# EAGLE schematic owl-digital-2 (EAGLE 6.6.0)
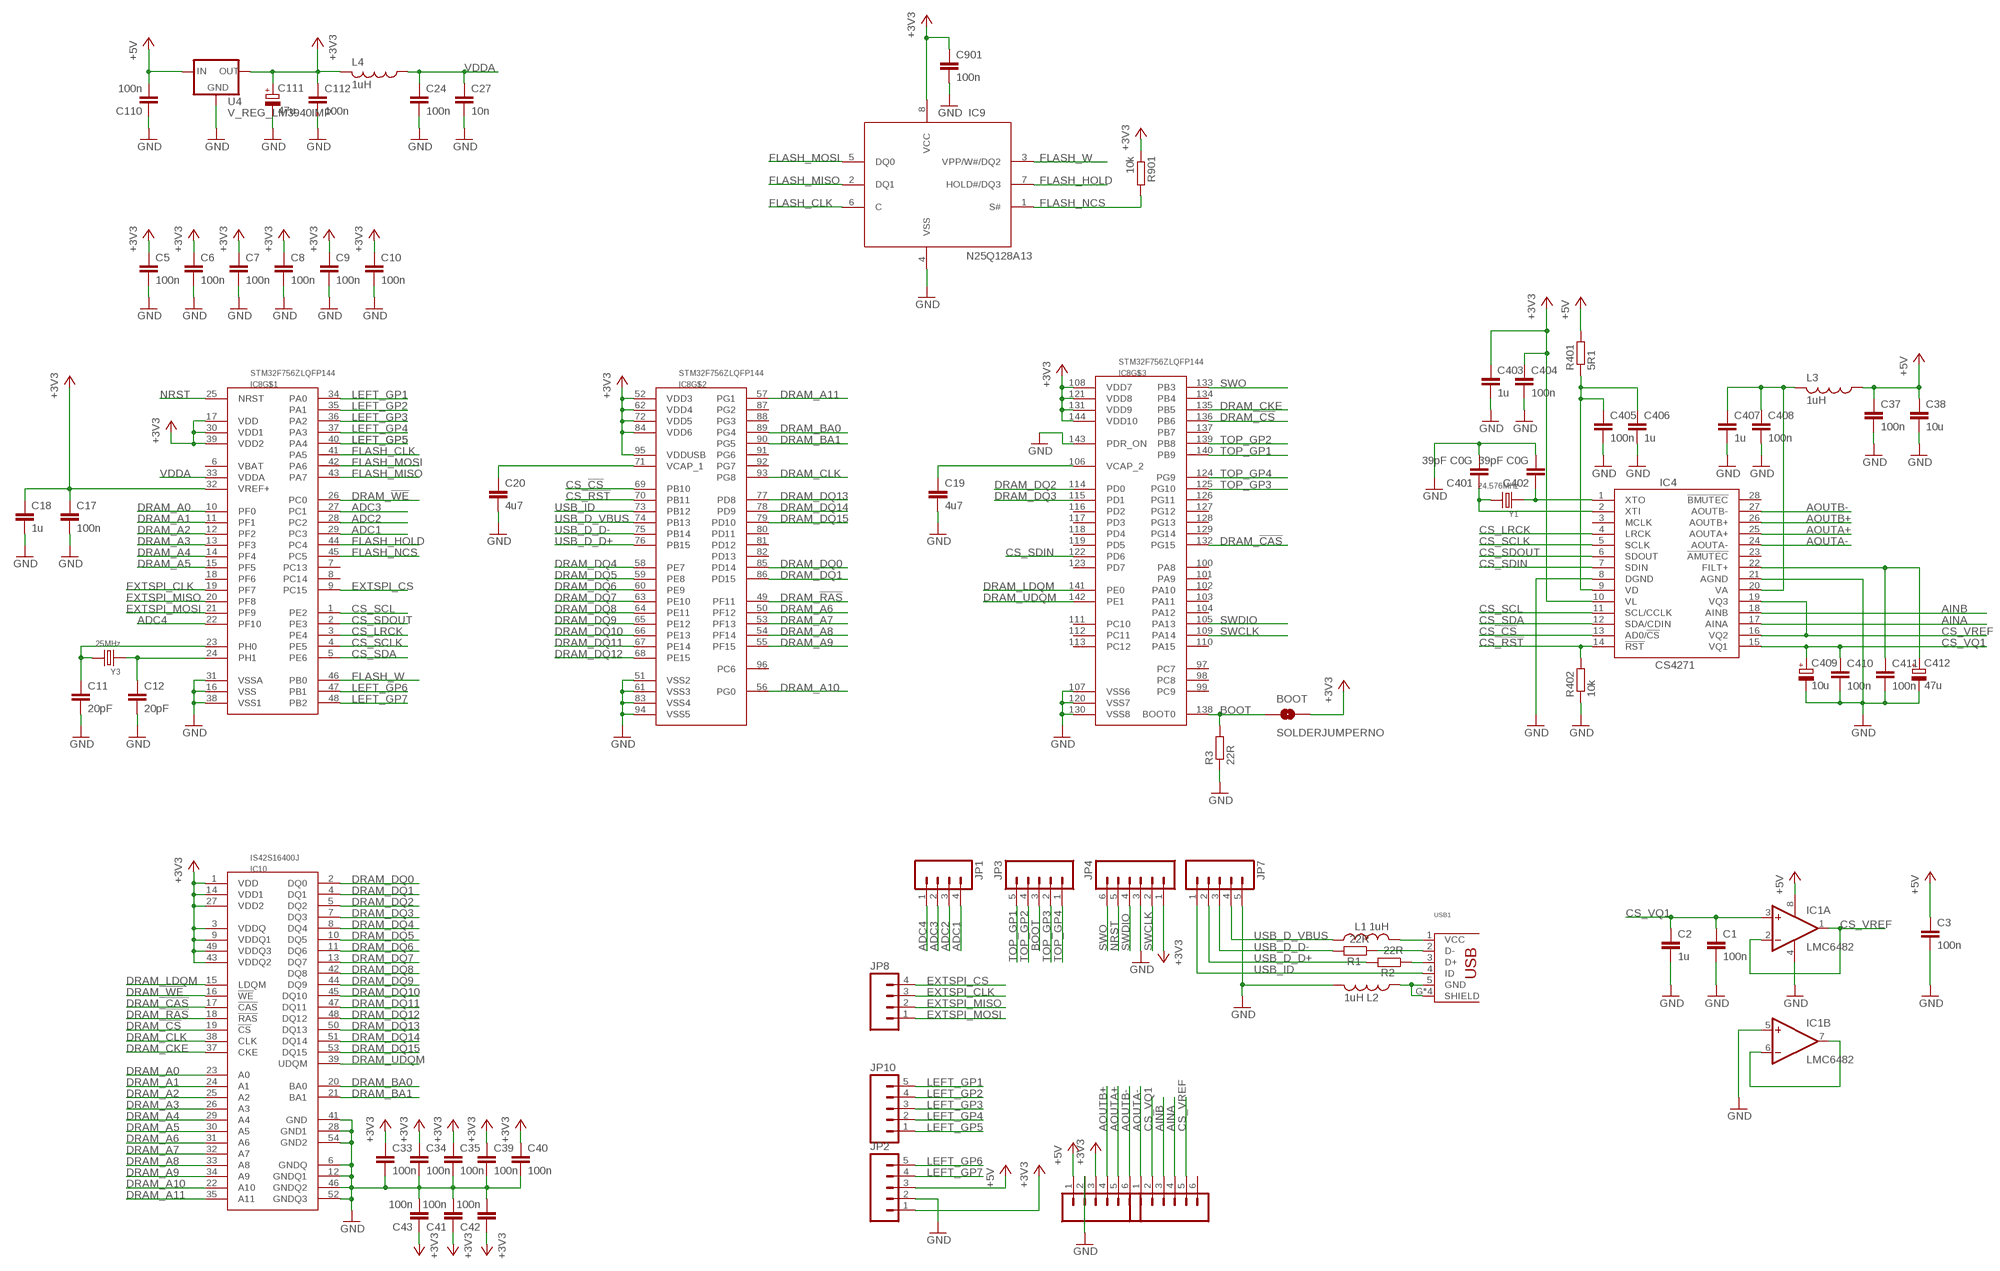
[diagram p0: schematic, sheet 1]

## Parts
BOOT  SOLDERJUMPERNO  [SJ_2S-NO]
C1  100n  C-EUC0603  [C0603]
C2  1u  C-EUC0603  [C0603]
C3  100n  C-EUC0603  [C0603]
C5  100n  C-EUC0603  [C0603]
C6  100n  C-EUC0603  [C0603]
C7  100n  C-EUC0603  [C0603]
C8  100n  C-EUC0603  [C0603]
C9  100n  C-EUC0603  [C0603]
C10  100n  C-EUC0603  [C0603]
C11  20pF  C-EUC0603  [C0603]
C12  20pF  C-EUC0603  [C0603]
C17  100n  C-EUC0603  [C0603]
C18  1u  C-EUC0603  [C0603]
C19  4u7  C-EUC0603  [C0603]
C20  4u7  C-EUC0603  [C0603]
C24  100n  C-EUC0603  [C0603]
C27  10n  C-EUC0603  [C0603]
C33  100n  C-EUC0603  [C0603]
C34  100n  C-EUC0603  [C0603]
C35  100n  C-EUC0603  [C0603]
C37  100n  C-EUC0603  [C0603]
C38  10u  C-EUC1206  [C1206]
C39  100n  C-EUC0603  [C0603]
C40  100n  C-EUC0603  [C0603]
C41  100n  C-EUC0603  [C0603]
C42  100n  C-EUC0603  [C0603]
C43  100n  C-EUC0603  [C0603]
C110  100n  C-EUC0603  [C0603]
C111  47u  CPOL-EU153CLV-0505  [CPOL-5]
C112  100n  C-EUC0603  [C0603]
C401  39pF C0G  C-EUC0603  [C0603]
C402  39pF C0G  C-EUC0603  [C0603]
C403  1u  C-EUC0603  [C0603]
C404  100n  C-EUC0603  [C0603]
C405  100n  C-EUC0603  [C0603]
C406  1u  C-EUC0603  [C0603]
C407  1u  C-EUC0603  [C0603]
C408  100n  C-EUC0603  [C0603]
C409  10u  CPOL-EU153CLV-0505  [CPOL-5]
C410  100n  C-EUC0603  [C0603]
C411  100n  C-EUC0603  [C0603]
C412  47u  CPOL-EU153CLV-0505  [CPOL-5]
C901  100n  C-EUC0603  [C0603]
IC1  LMC6482  LM1458D  [SO08]
IC4  CS4271  [TSSOP28-0.65-9.7X4.4MM]
IC8  STM32F756ZLQFP144  [QFP50P2200X2200X160-144N]
IC9  N25Q128A13  [SO8W]
IC10  IS42S16400J  [TSOP54-400]
JP1  M04PTH  [1X04]
JP2  M05PTH  [1X05]
JP3  M05PTH  [1X05]
JP4  M06SIP  [1X06]
JP5  M06SIP  [1X06]
JP6  M06SIP  [1X06]
JP7  M05PTH  [1X05]
JP8  M04PTH  [1X04]
JP10  M05PTH  [1X05]
L1  1uH  INDUCTOR  [0603]
L2  1uH  INDUCTOR  [0603]
L3  1uH  INDUCTOR  [0603]
L4  1uH  INDUCTOR  [0603]
R1  22R  R-EU_0603  [0603]
R2  22R  R-EU_0603  [0603]
R3  22R  R-EU_0603  [0603]
R401  5R1  R-EU_0603  [0603]
R402  10k  R-EU_0603  [0603]
R901  10k  R-EU_0603  [0603]
U4  V_REG_LM3940IMP  [SOT223]
USB1  USB_HRS_ZX62-B-5PA(11)MICRO.B  [HRS_ZX62RD-AB-5P8]
Y1  24.576MHz  SMD-CRYSTAL-8MHZ-20PF-20PPM(2P-5.0X3.2MM)  [X2-SMD-5.0X3.2X1.3MM]
Y3  25MHz  SMD-CRYSTAL-8MHZ-20PF-20PPM(2P-5.0X3.2MM)  [X2-SMD-5.0X3.2X1.3MM]

## Nets
+3V3: BOOT.2 C5.1 C6.1 C7.1 C8.1 C9.1 C10.1 C17.1 C18.1 C33.1 C34.1 C35.1 C39.1 C40.1 C41.1 C42.1 C43.1 C111.+ C112.1 C403.1 C404.1 C901.1 IC4.10(VL) IC8.17(VDD) IC8.30(VDD1) IC8.32(VREF+) IC8.39(VDD2) IC8.52(VDD3) IC8.62(VDD4) IC8.72(VDD5) IC8.84(VDD6) IC8.95(VDDUSB) IC8.108(VDD7) IC8.121(VDD8) IC8.131(VDD9) IC8.144(VDD10) IC9.8(VCC) IC10.1(VDD) IC10.3(VDDQ) IC10.9(VDDQ1) IC10.14(VDD1) IC10.27(VDD2) IC10.43(VDDQ2) IC10.49(VDDQ3) JP2.1 JP4.1 JP5.3 L4.2 R901.1 U4.3(OUT)
+5V [power]: C3.1 C37.1 C38.1 C110.2 IC1.8(P:V+) JP2.3 JP5.1 L3.1 R401.2 U4.1(IN)
ADC1: IC8.29(PC3) JP1.4
ADC2: IC8.28(PC2) JP1.3
ADC3: IC8.27(PC1) JP1.2
ADC4: IC8.22(PF10) JP1.1
AINA: IC4.17(AINA) JP6.4
AINB: IC4.18(AINB) JP6.3
AOUTA+: IC4.25(AOUTA+) JP5.5
AOUTA-: IC4.24(AOUTA-) JP6.1
AOUTB+: IC4.26(AOUTB+) JP5.4
AOUTB-: IC4.27(AOUTB-) JP5.6
BOOT: BOOT.1 IC8.138(BOOT0) JP3.3 R3.2
CS_!CS: IC4.13(AD0/!CS) IC8.69(PB10)
CS_!RST: IC4.14(!RST) IC8.70(PB11) R402.2
CS_LRCK: IC4.4(LRCK) IC8.3(PE4)
CS_SCL: IC4.11(SCL/CCLK) IC8.1(PE2)
CS_SCLK: IC4.5(SCLK) IC8.4(PE5)
CS_SDA: IC4.12(SDA/CDIN) IC8.5(PE6)
CS_SDIN: IC4.7(SDIN) IC8.122(PD6)
CS_SDOUT: IC4.6(SDOUT) IC8.2(PE3)
CS_VQ1: C1.1 C2.1 C409.+ C410.1 IC1.3(A:+IN) IC4.15(VQ1) JP6.2
CS_VREF: IC1.1(A:OUT) IC1.2(A:-IN) IC4.16(VQ2) IC4.19(VQ3) JP6.5
DRAM_!CAS: IC8.132(PG15) IC10.17(!CAS)
DRAM_!CS: IC8.136(PB6) IC10.19(!CS)
DRAM_!RAS: IC8.49(PF11) IC10.18(!RAS)
DRAM_!WE: IC8.26(PC0) IC10.16(!WE)
DRAM_A0: IC8.10(PF0) IC10.23(A0)
DRAM_A1: IC8.11(PF1) IC10.24(A1)
DRAM_A2: IC8.12(PF2) IC10.25(A2)
DRAM_A3: IC8.13(PF3) IC10.26(A3)
DRAM_A4: IC8.14(PF4) IC10.29(A4)
DRAM_A5: IC8.15(PF5) IC10.30(A5)
DRAM_A6: IC8.50(PF12) IC10.31(A6)
DRAM_A7: IC8.53(PF13) IC10.32(A7)
DRAM_A8: IC8.54(PF14) IC10.33(A8)
DRAM_A9: IC8.55(PF15) IC10.34(A9)
DRAM_A10: IC8.56(PG0) IC10.22(A10)
DRAM_A11: IC8.57(PG1) IC10.35(A11)
DRAM_BA0: IC8.89(PG4) IC10.20(BA0)
DRAM_BA1: IC8.90(PG5) IC10.21(BA1)
DRAM_CKE: IC8.135(PB5) IC10.37(CKE)
DRAM_CLK: IC8.93(PG8) IC10.38(CLK)
DRAM_DQ0: IC8.85(PD14) IC10.2(DQ0)
DRAM_DQ1: IC8.86(PD15) IC10.4(DQ1)
DRAM_DQ2: IC8.114(PD0) IC10.5(DQ2)
DRAM_DQ3: IC8.115(PD1) IC10.7(DQ3)
DRAM_DQ4: IC8.58(PE7) IC10.8(DQ4)
DRAM_DQ5: IC8.59(PE8) IC10.10(DQ5)
DRAM_DQ6: IC8.60(PE9) IC10.11(DQ6)
DRAM_DQ7: IC8.63(PE10) IC10.13(DQ7)
DRAM_DQ8: IC8.64(PE11) IC10.42(DQ8)
DRAM_DQ9: IC8.65(PE12) IC10.44(DQ9)
DRAM_DQ10: IC8.66(PE13) IC10.45(DQ10)
DRAM_DQ11: IC8.67(PE14) IC10.47(DQ11)
DRAM_DQ12: IC8.68(PE15) IC10.48(DQ12)
DRAM_DQ13: IC8.77(PD8) IC10.50(DQ13)
DRAM_DQ14: IC8.78(PD9) IC10.51(DQ14)
DRAM_DQ15: IC8.79(PD10) IC10.53(DQ15)
DRAM_LDQM: IC8.141(PE0) IC10.15(LDQM)
DRAM_UDQM: IC8.142(PE1) IC10.39(UDQM)
EXTSPI_CLK: IC8.19(PF7) JP8.3
EXTSPI_CS: IC8.9(PC15) JP8.4
EXTSPI_MISO: IC8.20(PF8) JP8.2
EXTSPI_MOSI: IC8.21(PF9) JP8.1
FLASH_CLK: IC8.41(PA5) IC9.6(C)
FLASH_HOLD: IC8.44(PC4) IC9.7(HOLD#/DQ3)
FLASH_MISO: IC8.43(PA7) IC9.2(DQ1)
FLASH_MOSI: IC8.42(PA6) IC9.5(DQ0)
FLASH_NCS: IC8.45(PC5) IC9.1(S#) R901.2
FLASH_W: IC8.46(PB0) IC9.3(VPP/W#/DQ2)
GND: C1.2 C2.2 C3.2 C5.2 C6.2 C7.2 C8.2 C9.2 C10.2 C11.2 C12.2 C17.2 C18.2 C19.2 C20.2 C24.2 C27.2 C33.2 C34.2 C35.2 C37.2 C38.2 C39.2 C40.2 C41.2 C42.2 C43.2 C110.1 C111.- C112.2 C401.2 C402.2 C403.2 C404.2 C405.2 C406.2 C407.2 C408.2 C409.- C410.2 C411.2 C412.- C901.2 IC1.4(P:V-) IC1.5(B:+IN) IC4.8(DGND) IC4.21(AGND) IC8.16(VSS) IC8.31(VSSA) IC8.38(VSS1) IC8.51(VSS2) IC8.61(VSS3) IC8.83(VSS4) IC8.94(VSS5) IC8.107(VSS6) IC8.120(VSS7) IC8.130(VSS8) IC8.143(PDR_ON) IC9.4(VSS) IC10.6(GNDQ) IC10.12(GNDQ1) IC10.28(GND1) IC10.41(GND) IC10.46(GNDQ2) IC10.52(GNDQ3) IC10.54(GND2) JP2.2 JP4.3 JP5.2 JP7.5 L2.2 R3.1 R402.1 U4.2(GND)
LEFT_GP1: IC8.34(PA0) JP10.5
LEFT_GP2: IC8.35(PA1) JP10.4
LEFT_GP3: IC8.36(PA2) JP10.3
LEFT_GP4: IC8.37(PA3) JP10.2
LEFT_GP5: IC8.40(PA4) JP10.1
LEFT_GP6: IC8.47(PB1) JP2.5
LEFT_GP7: IC8.48(PB2) JP2.4
N$1: L2.1 USB1.5(GND) USB1.G2(SHIELD) USB1.G3(SHIELD) USB1.G4(SHIELD) USB1.G(SHIELD)
N$2: L1.2 USB1.1(VCC)
N$3: IC1.6(B:-IN) IC1.7(B:OUT)
N$4: R2.1 USB1.3(D+)
N$5: R1.1 USB1.2(D-)
N$11: C12.1 IC8.24(PH1) Y3.1
N$17: C11.1 IC8.23(PH0) Y3.2
N$18: C402.1 IC4.1(XTO) Y1.1
N$20: C411.1 C412.+ IC4.22(FILT+)
N$21: C401.1 IC4.2(XTI) Y1.2
N$33: C19.1 IC8.106(VCAP_2)
N$34: C20.1 IC8.71(VCAP_1)
NRST: IC8.25(NRST) JP4.5
SWCLK: IC8.109(PA14) JP4.2
SWDIO: IC8.105(PA13) JP4.4
SWO: IC8.133(PB3) JP4.6
TOP_GP1: IC8.140(PB9) JP3.5
TOP_GP2: IC8.139(PB8) JP3.4
TOP_GP3: IC8.125(PG10) JP3.2
TOP_GP4: IC8.124(PG9) JP3.1
USB_D_D+: IC8.76(PB15) JP7.2 R2.2
USB_D_D-: IC8.75(PB14) JP7.3 R1.2
USB_D_VBUS: IC8.74(PB13) JP7.4 L1.1
USB_ID: IC8.73(PB12) JP7.1 USB1.4(ID)
VA: C407.1 C408.1 IC4.20(VA) L3.2
VD: C405.1 C406.1 IC4.9(VD) R401.1
VDDA: C24.1 C27.1 IC8.33(VDDA) L4.1
Unconnected: IC4.3(MCLK) IC4.23(!AMUTEC) IC4.28(!BMUTEC) IC8.6(VBAT) IC8.7(PC13) IC8.8(PC14) IC8.18(PF6) IC8.80(PD11) IC8.81(PD12) IC8.82(PD13) IC8.87(PG2) IC8.88(PG3) IC8.91(PG6) IC8.92(PG7) IC8.96(PC6) IC8.97(PC7) IC8.98(PC8) IC8.99(PC9) IC8.100(PA8) IC8.101(PA9) IC8.102(PA10) IC8.103(PA11) IC8.104(PA12) IC8.110(PA15) IC8.111(PC10) IC8.112(PC11) IC8.113(PC12) IC8.116(PD2) IC8.117(PD3) IC8.118(PD4) IC8.119(PD5) IC8.123(PD7) IC8.126(PG11) IC8.127(PG12) IC8.128(PG13) IC8.129(PG14) IC8.134(PB4) IC8.137(PB7) JP6.6

## Library data of the parts
BOOT = SparkFun:SOLDERJUMPER: Solder Jumper Standard SMD solder jumper. Used to automate production. Two varients : Normally Open and Normally Closed are the same, but have different paste layers. NC will have a large amount of paste and should jumper during reflow.
C1-C3 C5-C12 C17-C20 C24 C27 C33-C35 C37-C43 C110 C112 C401-C408 C410 C411 C901 = Rebel:C-EU: CAPACITOR, European symbol
C111 C409 C412 = Rebel:CPOL-EU: POLARIZED CAPACITOR, European symbol
IC1 = linear:*1458: OP AMP
IC4 = Rebel:CS4271
IC8 = James:STM32F756Z; OC_FARNELL: 2484975
IC9 = Rebel:N25Q128A13: N25Q128A13 Flash Memory SO8W; OC_FARNELL: 2253682
IC10 = James:IS42S16400J; OC_FARNELL: 2253831
JP1 JP8 = SparkFun:M04: Header 4 Standard 4-pin 0.1" header. Use with straight break away headers (SKU : PRT-00116), right angle break away headers (PRT-00553), swiss pins (PRT-00743), machine pins (PRT-00117), and female headers (PRT-00115). Molex polarized connector foot print use with SKU : PRT-08231 with associated crimp pins and housings. 1MM SMD Version SKU: PRT-10208
JP2 JP3 JP7 JP10 = SparkFun:M05: Header 5 Standard 5-pin 0.1" header. Use with straight break away headers (SKU : PRT-00116), right angle break away headers (PRT-00553), swiss pins (PRT-00743), machine pins (PRT-00117), and female headers (PRT-00115). Molex polarized connector foot print use with SKU : PRT-08230 with associated crimp pins and housings.
JP4-JP6 = SparkFun:M06: Header 6 Standard 6-pin 0.1" header. Use with straight break away headers (SKU : PRT-00116), right angle break away headers (PRT-00553), swiss pins (PRT-00743), machine pins (PRT-00117), and female headers (PRT-00115). Molex polarized connector foot print use with SKU : PRT-08094 with associated crimp pins and housings. NOTES ON THE VARIANTS LOCK and LOCK_LONGPADS... This footprint was designed to help hold the alignment of a through-hole component (i.e. 6-pin header) while soldering it into place. You may notice that each hole has been shifted either up or down by 0.005 of an inch from it's more standard position (which is a perfectly straight line). This slight alteration caused the pins (the squares in the middle) to touch the edges of the holes. Because they are alternating, it causes a "brace" to hold the component in place. 0.005 has proven to be the perfect amount of "off-center" position when using our standard breakaway headers. Although looks a little odd when you look at the bare footprint, once you have a header in there, the alteration is very hard to notice. Also, if you push a header all the way into place, it is covered up entirely on the bottom side. This idea of altering the position of holes to aid alignment will be further integrated into the Sparkfun Library for other footprints. It can help hold any component with 3 or more connection pins.
L1-L4 = Rebel:INDUCTOR; OC_FARNELL: 2288736
R1-R3 R401 R402 R901 = Rebel:R-EU_: RESISTOR, European symbol
U4 = James:V_REG_LM3940IMP: LM3940IMP Fixed LDO Voltage Regulator Farnell: 1469104; OC_FARNELL: 1469104
USB1 = Rebel:USB_HRS_ZX62-B-5PA(11)MICRO.B
Y1 Y3 = Seeed-OPL-crystal-osctllator:SMD-CRYSTAL-8MHZ-20PF-20PPM(2P-5.0X3.2MM): 306010004; MPN: 5032/2P; VALUE: 5032/2p

## Net classes
1 power: width 0.178 mm, drill 0.305 mm, clearance 0.178 mm to class 0, clearance 0.178 mm